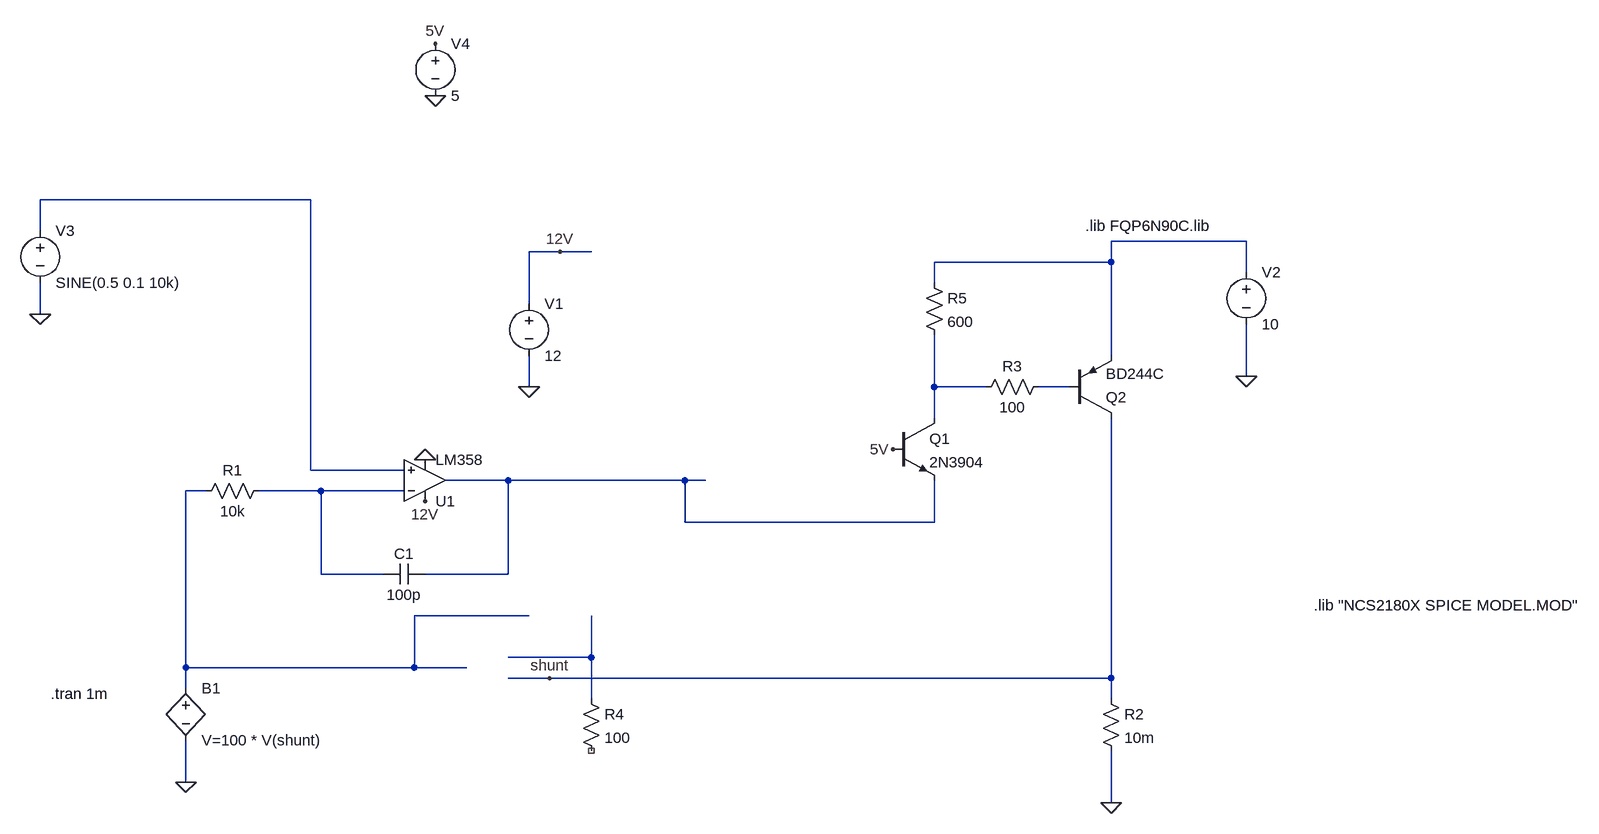
[diagram p0: schematic pnp_load.asc]
pnp_load.asc, the LTspice schematic file:
Version 4
SHEET 1 2060 692
WIRE 96 -256 -320 -256
WIRE -320 -208 -320 -256
WIRE 1536 -192 1328 -192
WIRE 480 -176 432 -176
WIRE 528 -176 480 -176
WIRE 1328 -160 1328 -192
WIRE 1328 -160 1056 -160
WIRE 1536 -144 1536 -192
WIRE 1056 -128 1056 -160
WIRE 432 -96 432 -176
WIRE -320 -80 -320 -128
WIRE 1328 -16 1328 -160
WIRE 1536 16 1536 -64
WIRE 432 32 432 -16
WIRE 1056 32 1056 -48
WIRE 1136 32 1056 32
WIRE 1264 32 1216 32
WIRE 1056 80 1056 32
WIRE 96 160 96 -256
WIRE 240 160 96 160
WIRE 400 176 304 176
WIRE 672 176 400 176
WIRE 704 176 672 176
WIRE -64 192 -96 192
WIRE 112 192 16 192
WIRE 240 192 112 192
WIRE 672 240 672 176
WIRE 1056 240 1056 176
WIRE 1056 240 672 240
WIRE 112 320 112 192
WIRE 208 320 112 320
WIRE 400 320 400 176
WIRE 400 320 272 320
WIRE 432 384 256 384
WIRE 528 448 528 384
WIRE 528 448 400 448
WIRE -96 464 -96 192
WIRE 256 464 256 384
WIRE 256 464 -96 464
WIRE 336 464 256 464
WIRE 464 480 400 480
WIRE 1328 480 1328 80
WIRE 1328 480 464 480
WIRE -96 496 -96 464
WIRE 528 512 528 448
WIRE 1328 512 1328 480
WIRE -96 640 -96 576
WIRE 1328 672 1328 592
FLAG 272 144 0
FLAG 272 208 12V
FLAG 480 -176 12V
FLAG 432 32 0
FLAG 1328 672 0
FLAG 1536 16 0
FLAG 464 480 shunt
FLAG -320 -80 0
FLAG 288 -496 5V
FLAG 288 -416 0
FLAG -96 640 0
FLAG 992 128 5V
SYMBOL voltage 432 -112 R0
WINDOW 123 0 0 Left 0
WINDOW 39 0 0 Left 0
SYMATTR InstName V1
SYMATTR Value 12
SYMBOL res 32 176 R90
WINDOW 0 0 56 VBottom 2
WINDOW 3 32 56 VTop 2
SYMATTR InstName R1
SYMATTR Value 10k
SYMBOL cap 272 304 R90
WINDOW 0 0 32 VBottom 2
WINDOW 3 32 32 VTop 2
SYMATTR InstName C1
SYMATTR Value 100p
SYMBOL res 1312 496 R0
SYMATTR InstName R2
SYMATTR Value 10m
SYMBOL voltage 1536 -160 R0
WINDOW 123 0 0 Left 0
WINDOW 39 0 0 Left 0
SYMATTR InstName V2
SYMATTR Value 10
SYMBOL voltage -320 -224 R0
WINDOW 123 0 0 Left 0
WINDOW 39 0 0 Left 0
SYMATTR InstName V3
SYMATTR Value SINE(0.5 0.1 10k)
SYMBOL res 1232 16 R90
WINDOW 0 0 56 VBottom 2
WINDOW 3 32 56 VTop 2
SYMATTR InstName R3
SYMATTR Value 100
SYMBOL ZZZ\\OpAmp\\LM358 272 176 M180
SYMATTR InstName U1
SYMBOL res 512 496 R0
SYMATTR InstName R4
SYMATTR Value 100
SYMBOL voltage 288 -512 R0
WINDOW 123 0 0 Left 0
WINDOW 39 0 0 Left 0
SYMATTR InstName V4
SYMATTR Value 5
SYMBOL npn 992 80 R0
SYMATTR InstName Q1
SYMATTR Value 2N3904
SYMBOL bv -96 480 R0
SYMATTR InstName B1
SYMATTR Value V=100 * V(shunt)
SYMBOL pnp 1264 80 M180
SYMATTR InstName Q2
SYMATTR Value BD244C
SYMBOL res 1040 -144 R0
SYMATTR InstName R5
SYMATTR Value 600
TEXT -304 504 Left 2 !.tran 1m
TEXT 1288 -216 Left 2 !.lib FQP6N90C.lib
TEXT 1640 368 Left 2 !.lib "NCS2180X SPICE MODEL.MOD"

The netlist it stands for:
* pnp_load.asc
V1 12V 0 12
R1 N007 N006 10k
C1 N005 N007 100p
R2 shunt 0 10m
V2 N002 0 10
V3 N001 0 SINE(0.5 0.1 10k)
R3 N004 N003 100
XU1 N001 N007 12V 0 N005 LM358  ; pins In+ In- V+ V- OUT
R4 N008 NC_01 100
V4 5V 0 5
Q1 N003 5V N005 0 2N3904
B1 N006 0 V=100 * V(shunt)
Q2 shunt N004 N002 0 BD244C
R5 N002 N003 600
.model NPN NPN
.model PNP PNP
.lib standard.bjt
.tran 1m
.lib FQP6N90C.lib
.lib "NCS2180X SPICE MODEL.MOD"
.backanno
.end